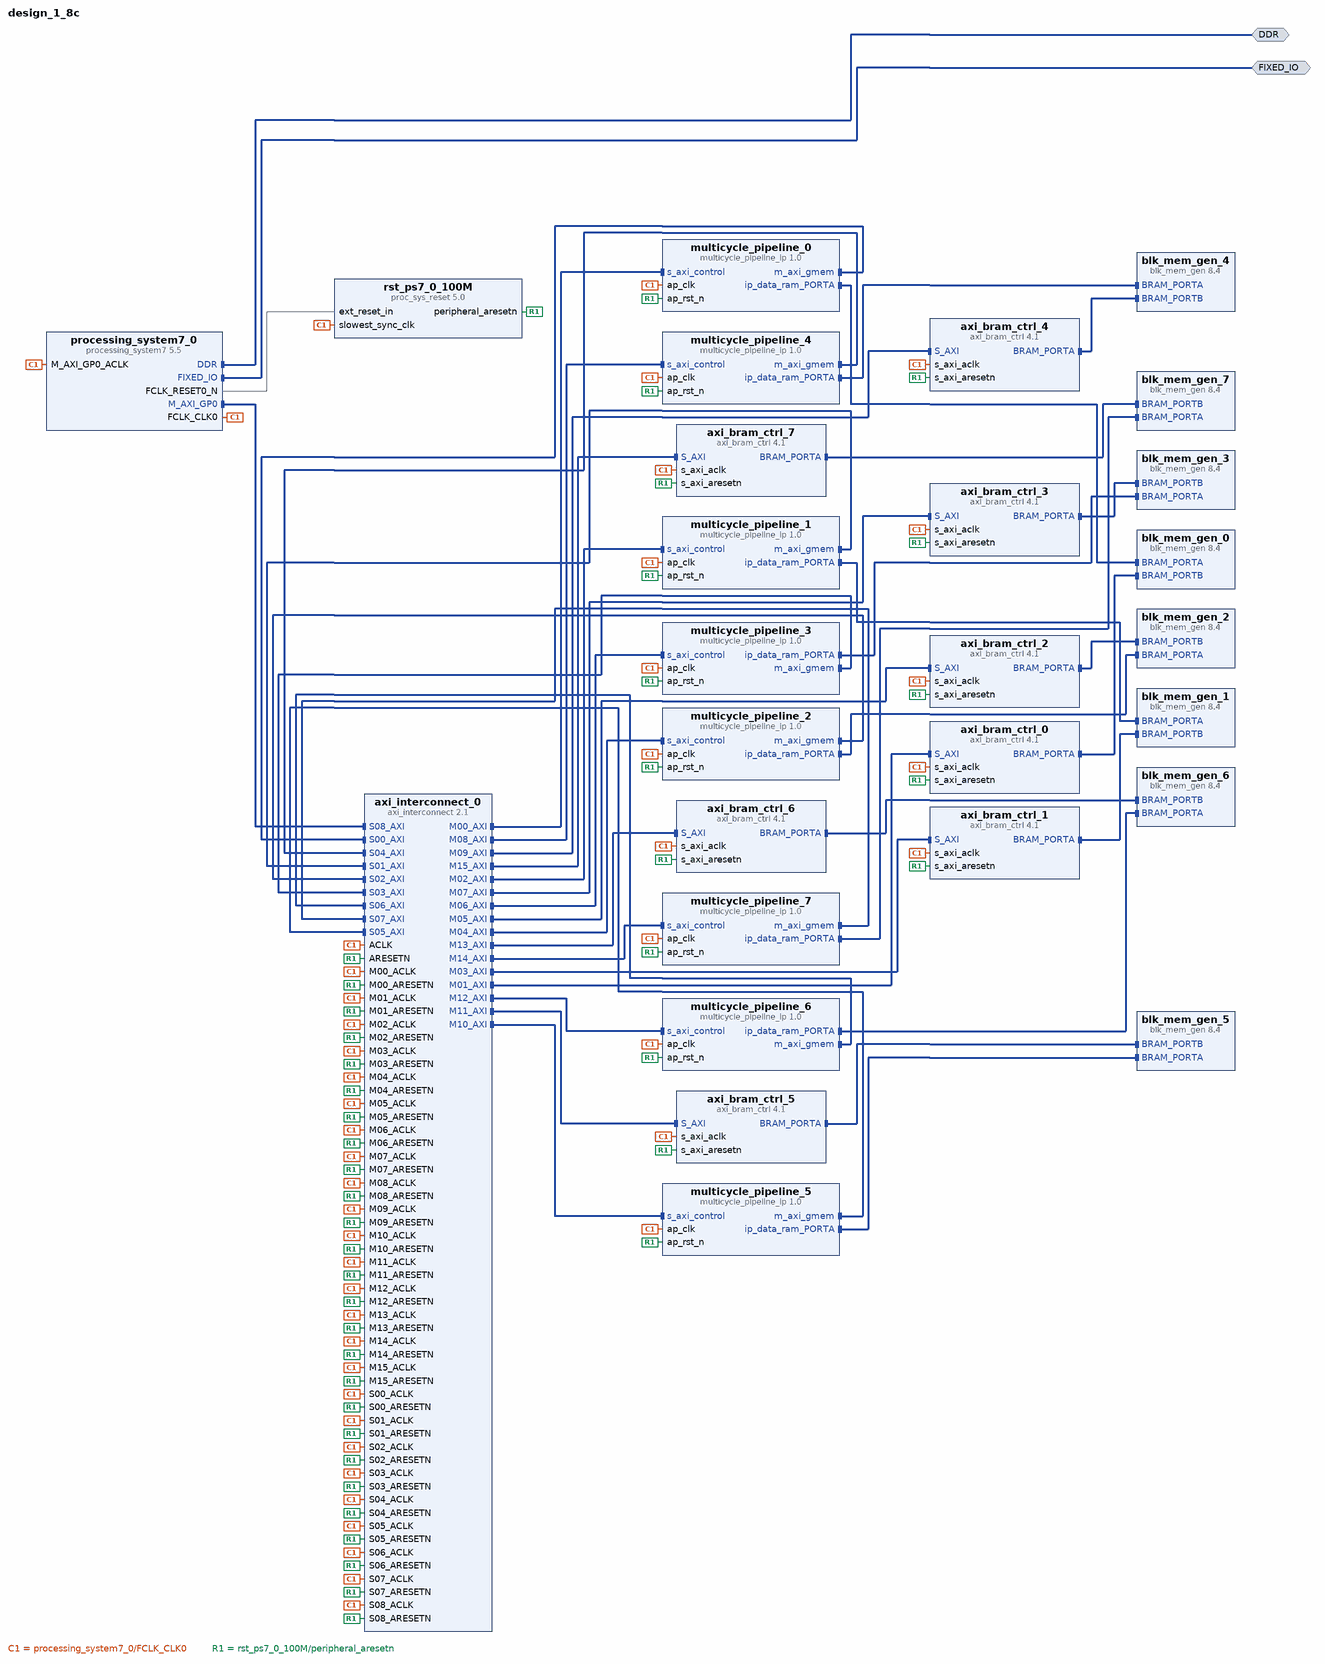
[diagram p0: block diagram of the top level]
# Vivado block design design_1_8c, xc7z020clg400-1, Vivado 2022.1
create_bd_design design_1_8c

create_bd_intf_port -mode Master -vlnv xilinx.com:interface:ddrx_rtl:1.0 DDR
create_bd_intf_port -mode Master -vlnv xilinx.com:display_processing_system7:fixedio_rtl:1.0 FIXED_IO

create_bd_cell -type ip -vlnv xilinx.com:ip:processing_system7:5.5 processing_system7_0
set_property -dict [list \
  CONFIG.PCW_APU_PERIPHERAL_FREQMHZ 650 \
  CONFIG.PCW_CRYSTAL_PERIPHERAL_FREQMHZ 50 \
  CONFIG.PCW_ENET0_ENET0_IO {MIO 16 .. 27} \
  CONFIG.PCW_ENET0_GRP_MDIO_ENABLE 1 \
  CONFIG.PCW_ENET0_GRP_MDIO_IO {MIO 52 .. 53} \
  CONFIG.PCW_ENET0_PERIPHERAL_ENABLE 1 \
  CONFIG.PCW_ENET0_RESET_ENABLE 1 \
  CONFIG.PCW_ENET0_RESET_IO {MIO 9} \
  CONFIG.PCW_ENET_RESET_ENABLE 1 \
  CONFIG.PCW_ENET_RESET_SELECT {Share reset pin} \
  CONFIG.PCW_FPGA0_PERIPHERAL_FREQMHZ 100 \
  CONFIG.PCW_FPGA1_PERIPHERAL_FREQMHZ 50 \
  CONFIG.PCW_GPIO_MIO_GPIO_ENABLE 1 \
  CONFIG.PCW_GPIO_MIO_GPIO_IO MIO \
  CONFIG.PCW_I2C_RESET_ENABLE 1 \
  CONFIG.PCW_M_AXI_GP0_FREQMHZ 10 \
  CONFIG.PCW_PERIPHERAL_BOARD_PRESET None \
  CONFIG.PCW_PRESET_BANK1_VOLTAGE {LVCMOS 1.8V} \
  CONFIG.PCW_QSPI_GRP_FBCLK_ENABLE 1 \
  CONFIG.PCW_QSPI_GRP_FBCLK_IO {MIO 8} \
  CONFIG.PCW_QSPI_GRP_SINGLE_SS_ENABLE 1 \
  CONFIG.PCW_QSPI_GRP_SINGLE_SS_IO {MIO 1 .. 6} \
  CONFIG.PCW_QSPI_PERIPHERAL_ENABLE 1 \
  CONFIG.PCW_QSPI_QSPI_IO {MIO 1 .. 6} \
  CONFIG.PCW_SD0_GRP_CD_ENABLE 1 \
  CONFIG.PCW_SD0_GRP_CD_IO {MIO 47} \
  CONFIG.PCW_SD0_GRP_WP_ENABLE 0 \
  CONFIG.PCW_SD0_PERIPHERAL_ENABLE 1 \
  CONFIG.PCW_SD0_SD0_IO {MIO 40 .. 45} \
  CONFIG.PCW_SDIO_PERIPHERAL_FREQMHZ 50 \
  CONFIG.PCW_SINGLE_QSPI_DATA_MODE x4 \
  CONFIG.PCW_UART0_PERIPHERAL_ENABLE 1 \
  CONFIG.PCW_UART0_UART0_IO {MIO 14 .. 15} \
  CONFIG.PCW_UART1_PERIPHERAL_ENABLE 0 \
  CONFIG.PCW_UART_PERIPHERAL_FREQMHZ 100 \
  CONFIG.PCW_UIPARAM_DDR_BUS_WIDTH {16 Bit} \
  CONFIG.PCW_UIPARAM_DDR_FREQ_MHZ 525 \
  CONFIG.PCW_UIPARAM_DDR_PARTNO {MT41J256M16 RE-125} \
  CONFIG.PCW_USB0_PERIPHERAL_ENABLE 1 \
  CONFIG.PCW_USB0_RESET_ENABLE 1 \
  CONFIG.PCW_USB0_RESET_IO {MIO 46} \
  CONFIG.PCW_USB0_USB0_IO {MIO 28 .. 39} \
  CONFIG.PCW_USB_RESET_ENABLE 1 \
  CONFIG.PCW_USB_RESET_SELECT {Share reset pin} \
] [get_bd_cells processing_system7_0]
# 481 more settings of processing_system7_0 are not shown: defaults, MIO pin electricals, DDR timing, and values the tool derives
create_bd_cell -type ip -vlnv xilinx.com:ip:axi_bram_ctrl:4.1 axi_bram_ctrl_0
set_property -dict {CONFIG.PROTOCOL AXI4LITE CONFIG.SINGLE_PORT_BRAM 1} [get_bd_cells axi_bram_ctrl_0]
create_bd_cell -type ip -vlnv xilinx.com:ip:axi_bram_ctrl:4.1 axi_bram_ctrl_1
set_property -dict {CONFIG.PROTOCOL AXI4LITE CONFIG.SINGLE_PORT_BRAM 1} [get_bd_cells axi_bram_ctrl_1]
create_bd_cell -type ip -vlnv xilinx.com:ip:axi_bram_ctrl:4.1 axi_bram_ctrl_2
set_property -dict {CONFIG.PROTOCOL AXI4LITE CONFIG.SINGLE_PORT_BRAM 1} [get_bd_cells axi_bram_ctrl_2]
create_bd_cell -type ip -vlnv xilinx.com:ip:axi_bram_ctrl:4.1 axi_bram_ctrl_3
set_property -dict {CONFIG.PROTOCOL AXI4LITE CONFIG.SINGLE_PORT_BRAM 1} [get_bd_cells axi_bram_ctrl_3]
create_bd_cell -type ip -vlnv xilinx.com:ip:axi_bram_ctrl:4.1 axi_bram_ctrl_4
set_property -dict {CONFIG.PROTOCOL AXI4LITE CONFIG.SINGLE_PORT_BRAM 1} [get_bd_cells axi_bram_ctrl_4]
create_bd_cell -type ip -vlnv xilinx.com:ip:axi_bram_ctrl:4.1 axi_bram_ctrl_5
set_property -dict {CONFIG.PROTOCOL AXI4LITE CONFIG.SINGLE_PORT_BRAM 1} [get_bd_cells axi_bram_ctrl_5]
create_bd_cell -type ip -vlnv xilinx.com:ip:axi_bram_ctrl:4.1 axi_bram_ctrl_6
set_property -dict {CONFIG.PROTOCOL AXI4LITE CONFIG.SINGLE_PORT_BRAM 1} [get_bd_cells axi_bram_ctrl_6]
create_bd_cell -type ip -vlnv xilinx.com:ip:axi_bram_ctrl:4.1 axi_bram_ctrl_7
set_property -dict {CONFIG.PROTOCOL AXI4LITE CONFIG.SINGLE_PORT_BRAM 1} [get_bd_cells axi_bram_ctrl_7]
create_bd_cell -type ip -vlnv xilinx.com:ip:blk_mem_gen:8.4 blk_mem_gen_0
set_property -dict [list \
  CONFIG.Enable_B Use_ENB_Pin \
  CONFIG.Memory_Type True_Dual_Port_RAM \
  CONFIG.Port_B_Clock 100 \
  CONFIG.Port_B_Enable_Rate 100 \
  CONFIG.Port_B_Write_Rate 50 \
  CONFIG.Use_RSTB_Pin true \
] [get_bd_cells blk_mem_gen_0]
create_bd_cell -type ip -vlnv xilinx.com:ip:blk_mem_gen:8.4 blk_mem_gen_1
set_property -dict [list \
  CONFIG.Enable_B Use_ENB_Pin \
  CONFIG.Memory_Type True_Dual_Port_RAM \
  CONFIG.Port_B_Clock 100 \
  CONFIG.Port_B_Enable_Rate 100 \
  CONFIG.Port_B_Write_Rate 50 \
  CONFIG.Use_RSTB_Pin true \
] [get_bd_cells blk_mem_gen_1]
create_bd_cell -type ip -vlnv xilinx.com:ip:blk_mem_gen:8.4 blk_mem_gen_2
set_property -dict [list \
  CONFIG.Enable_B Use_ENB_Pin \
  CONFIG.Memory_Type True_Dual_Port_RAM \
  CONFIG.Port_B_Clock 100 \
  CONFIG.Port_B_Enable_Rate 100 \
  CONFIG.Port_B_Write_Rate 50 \
  CONFIG.Use_RSTB_Pin true \
] [get_bd_cells blk_mem_gen_2]
create_bd_cell -type ip -vlnv xilinx.com:ip:blk_mem_gen:8.4 blk_mem_gen_3
set_property -dict [list \
  CONFIG.Enable_B Use_ENB_Pin \
  CONFIG.Memory_Type True_Dual_Port_RAM \
  CONFIG.Port_B_Clock 100 \
  CONFIG.Port_B_Enable_Rate 100 \
  CONFIG.Port_B_Write_Rate 50 \
  CONFIG.Use_RSTB_Pin true \
] [get_bd_cells blk_mem_gen_3]
create_bd_cell -type ip -vlnv xilinx.com:ip:blk_mem_gen:8.4 blk_mem_gen_4
set_property -dict [list \
  CONFIG.Enable_B Use_ENB_Pin \
  CONFIG.Memory_Type True_Dual_Port_RAM \
  CONFIG.Port_B_Clock 100 \
  CONFIG.Port_B_Enable_Rate 100 \
  CONFIG.Port_B_Write_Rate 50 \
  CONFIG.Use_RSTB_Pin true \
] [get_bd_cells blk_mem_gen_4]
create_bd_cell -type ip -vlnv xilinx.com:ip:blk_mem_gen:8.4 blk_mem_gen_5
set_property -dict [list \
  CONFIG.Enable_B Use_ENB_Pin \
  CONFIG.Memory_Type True_Dual_Port_RAM \
  CONFIG.Port_B_Clock 100 \
  CONFIG.Port_B_Enable_Rate 100 \
  CONFIG.Port_B_Write_Rate 50 \
  CONFIG.Use_RSTB_Pin true \
] [get_bd_cells blk_mem_gen_5]
create_bd_cell -type ip -vlnv xilinx.com:ip:blk_mem_gen:8.4 blk_mem_gen_6
set_property -dict [list \
  CONFIG.Enable_B Use_ENB_Pin \
  CONFIG.Memory_Type True_Dual_Port_RAM \
  CONFIG.Port_B_Clock 100 \
  CONFIG.Port_B_Enable_Rate 100 \
  CONFIG.Port_B_Write_Rate 50 \
  CONFIG.Use_RSTB_Pin true \
] [get_bd_cells blk_mem_gen_6]
create_bd_cell -type ip -vlnv xilinx.com:ip:blk_mem_gen:8.4 blk_mem_gen_7
set_property -dict [list \
  CONFIG.Enable_B Use_ENB_Pin \
  CONFIG.Memory_Type True_Dual_Port_RAM \
  CONFIG.Port_B_Clock 100 \
  CONFIG.Port_B_Enable_Rate 100 \
  CONFIG.Port_B_Write_Rate 50 \
  CONFIG.Use_RSTB_Pin true \
] [get_bd_cells blk_mem_gen_7]
create_bd_cell -type ip -vlnv xilinx.com:ip:proc_sys_reset:5.0 rst_ps7_0_100M
create_bd_cell -type ip -vlnv xilinx.com:ip:axi_interconnect:2.1 axi_interconnect_0
set_property -dict {CONFIG.NUM_MI 16 CONFIG.NUM_SI 9} [get_bd_cells axi_interconnect_0]
create_bd_cell -type ip -vlnv xilinx.com:hls:multicycle_pipeline_ip:1.0 multicycle_pipeline_0
create_bd_cell -type ip -vlnv xilinx.com:hls:multicycle_pipeline_ip:1.0 multicycle_pipeline_1
create_bd_cell -type ip -vlnv xilinx.com:hls:multicycle_pipeline_ip:1.0 multicycle_pipeline_2
create_bd_cell -type ip -vlnv xilinx.com:hls:multicycle_pipeline_ip:1.0 multicycle_pipeline_3
create_bd_cell -type ip -vlnv xilinx.com:hls:multicycle_pipeline_ip:1.0 multicycle_pipeline_4
create_bd_cell -type ip -vlnv xilinx.com:hls:multicycle_pipeline_ip:1.0 multicycle_pipeline_5
create_bd_cell -type ip -vlnv xilinx.com:hls:multicycle_pipeline_ip:1.0 multicycle_pipeline_6
create_bd_cell -type ip -vlnv xilinx.com:hls:multicycle_pipeline_ip:1.0 multicycle_pipeline_7

# ---- connections ----

connect_bd_intf_net [get_bd_intf_pins axi_interconnect_0/S08_AXI] [get_bd_intf_pins processing_system7_0/M_AXI_GP0]
connect_bd_intf_net [get_bd_intf_pins blk_mem_gen_0/BRAM_PORTB] [get_bd_intf_pins axi_bram_ctrl_0/BRAM_PORTA]
connect_bd_intf_net [get_bd_intf_pins blk_mem_gen_1/BRAM_PORTB] [get_bd_intf_pins axi_bram_ctrl_1/BRAM_PORTA]
connect_bd_intf_net [get_bd_intf_pins blk_mem_gen_2/BRAM_PORTB] [get_bd_intf_pins axi_bram_ctrl_2/BRAM_PORTA]
connect_bd_intf_net [get_bd_intf_pins blk_mem_gen_3/BRAM_PORTB] [get_bd_intf_pins axi_bram_ctrl_3/BRAM_PORTA]
connect_bd_intf_net [get_bd_intf_pins blk_mem_gen_4/BRAM_PORTB] [get_bd_intf_pins axi_bram_ctrl_4/BRAM_PORTA]
connect_bd_intf_net [get_bd_intf_pins blk_mem_gen_5/BRAM_PORTB] [get_bd_intf_pins axi_bram_ctrl_5/BRAM_PORTA]
connect_bd_intf_net [get_bd_intf_pins blk_mem_gen_6/BRAM_PORTB] [get_bd_intf_pins axi_bram_ctrl_6/BRAM_PORTA]
connect_bd_intf_net [get_bd_intf_pins blk_mem_gen_7/BRAM_PORTB] [get_bd_intf_pins axi_bram_ctrl_7/BRAM_PORTA]
connect_bd_intf_net [get_bd_intf_pins axi_interconnect_0/M00_AXI] [get_bd_intf_pins multicycle_pipeline_0/s_axi_control]
connect_bd_intf_net [get_bd_intf_pins axi_interconnect_0/M01_AXI] [get_bd_intf_pins axi_bram_ctrl_0/S_AXI]
connect_bd_intf_net [get_bd_intf_pins axi_interconnect_0/M02_AXI] [get_bd_intf_pins multicycle_pipeline_1/s_axi_control]
connect_bd_intf_net [get_bd_intf_pins axi_interconnect_0/M03_AXI] [get_bd_intf_pins axi_bram_ctrl_1/S_AXI]
connect_bd_intf_net [get_bd_intf_pins axi_interconnect_0/M04_AXI] [get_bd_intf_pins multicycle_pipeline_2/s_axi_control]
connect_bd_intf_net [get_bd_intf_pins axi_interconnect_0/M05_AXI] [get_bd_intf_pins axi_bram_ctrl_2/S_AXI]
connect_bd_intf_net [get_bd_intf_pins axi_interconnect_0/M06_AXI] [get_bd_intf_pins multicycle_pipeline_3/s_axi_control]
connect_bd_intf_net [get_bd_intf_pins axi_interconnect_0/M07_AXI] [get_bd_intf_pins axi_bram_ctrl_3/S_AXI]
connect_bd_intf_net [get_bd_intf_pins axi_interconnect_0/M08_AXI] [get_bd_intf_pins multicycle_pipeline_4/s_axi_control]
connect_bd_intf_net [get_bd_intf_pins axi_interconnect_0/M09_AXI] [get_bd_intf_pins axi_bram_ctrl_4/S_AXI]
connect_bd_intf_net [get_bd_intf_pins axi_interconnect_0/M10_AXI] [get_bd_intf_pins multicycle_pipeline_5/s_axi_control]
connect_bd_intf_net [get_bd_intf_pins axi_interconnect_0/M11_AXI] [get_bd_intf_pins axi_bram_ctrl_5/S_AXI]
connect_bd_intf_net [get_bd_intf_pins axi_interconnect_0/M12_AXI] [get_bd_intf_pins multicycle_pipeline_6/s_axi_control]
connect_bd_intf_net [get_bd_intf_pins axi_interconnect_0/M13_AXI] [get_bd_intf_pins axi_bram_ctrl_6/S_AXI]
connect_bd_intf_net [get_bd_intf_pins axi_interconnect_0/M14_AXI] [get_bd_intf_pins multicycle_pipeline_7/s_axi_control]
connect_bd_intf_net [get_bd_intf_pins axi_interconnect_0/M15_AXI] [get_bd_intf_pins axi_bram_ctrl_7/S_AXI]
connect_bd_intf_net [get_bd_intf_pins blk_mem_gen_0/BRAM_PORTA] [get_bd_intf_pins multicycle_pipeline_0/ip_data_ram_PORTA]
connect_bd_intf_net [get_bd_intf_pins multicycle_pipeline_0/m_axi_gmem] [get_bd_intf_pins axi_interconnect_0/S00_AXI]
connect_bd_intf_net [get_bd_intf_pins blk_mem_gen_1/BRAM_PORTA] [get_bd_intf_pins multicycle_pipeline_1/ip_data_ram_PORTA]
connect_bd_intf_net [get_bd_intf_pins multicycle_pipeline_1/m_axi_gmem] [get_bd_intf_pins axi_interconnect_0/S01_AXI]
connect_bd_intf_net [get_bd_intf_pins blk_mem_gen_2/BRAM_PORTA] [get_bd_intf_pins multicycle_pipeline_2/ip_data_ram_PORTA]
connect_bd_intf_net [get_bd_intf_pins multicycle_pipeline_2/m_axi_gmem] [get_bd_intf_pins axi_interconnect_0/S02_AXI]
connect_bd_intf_net [get_bd_intf_pins blk_mem_gen_3/BRAM_PORTA] [get_bd_intf_pins multicycle_pipeline_3/ip_data_ram_PORTA]
connect_bd_intf_net [get_bd_intf_pins multicycle_pipeline_3/m_axi_gmem] [get_bd_intf_pins axi_interconnect_0/S03_AXI]
connect_bd_intf_net [get_bd_intf_pins blk_mem_gen_4/BRAM_PORTA] [get_bd_intf_pins multicycle_pipeline_4/ip_data_ram_PORTA]
connect_bd_intf_net [get_bd_intf_pins multicycle_pipeline_4/m_axi_gmem] [get_bd_intf_pins axi_interconnect_0/S04_AXI]
connect_bd_intf_net [get_bd_intf_pins blk_mem_gen_5/BRAM_PORTA] [get_bd_intf_pins multicycle_pipeline_5/ip_data_ram_PORTA]
connect_bd_intf_net [get_bd_intf_pins multicycle_pipeline_5/m_axi_gmem] [get_bd_intf_pins axi_interconnect_0/S05_AXI]
connect_bd_intf_net [get_bd_intf_pins blk_mem_gen_6/BRAM_PORTA] [get_bd_intf_pins multicycle_pipeline_6/ip_data_ram_PORTA]
connect_bd_intf_net [get_bd_intf_pins multicycle_pipeline_6/m_axi_gmem] [get_bd_intf_pins axi_interconnect_0/S06_AXI]
connect_bd_intf_net [get_bd_intf_pins blk_mem_gen_7/BRAM_PORTA] [get_bd_intf_pins multicycle_pipeline_7/ip_data_ram_PORTA]
connect_bd_intf_net [get_bd_intf_pins multicycle_pipeline_7/m_axi_gmem] [get_bd_intf_pins axi_interconnect_0/S07_AXI]
connect_bd_intf_net [get_bd_intf_ports DDR] [get_bd_intf_pins processing_system7_0/DDR]
connect_bd_intf_net [get_bd_intf_ports FIXED_IO] [get_bd_intf_pins processing_system7_0/FIXED_IO]
connect_bd_net [get_bd_pins processing_system7_0/FCLK_CLK0] \
  [get_bd_pins axi_bram_ctrl_0/s_axi_aclk] [get_bd_pins rst_ps7_0_100M/slowest_sync_clk] \
  [get_bd_pins axi_bram_ctrl_1/s_axi_aclk] [get_bd_pins axi_bram_ctrl_2/s_axi_aclk] [get_bd_pins axi_bram_ctrl_3/s_axi_aclk] \
  [get_bd_pins axi_bram_ctrl_4/s_axi_aclk] [get_bd_pins axi_bram_ctrl_5/s_axi_aclk] [get_bd_pins axi_bram_ctrl_6/s_axi_aclk] \
  [get_bd_pins axi_bram_ctrl_7/s_axi_aclk] [get_bd_pins processing_system7_0/M_AXI_GP0_ACLK] \
  [get_bd_pins axi_interconnect_0/ACLK] [get_bd_pins axi_interconnect_0/M00_ACLK] [get_bd_pins axi_interconnect_0/M01_ACLK] \
  [get_bd_pins axi_interconnect_0/M02_ACLK] [get_bd_pins axi_interconnect_0/M03_ACLK] \
  [get_bd_pins axi_interconnect_0/M04_ACLK] [get_bd_pins axi_interconnect_0/M05_ACLK] \
  [get_bd_pins axi_interconnect_0/M06_ACLK] [get_bd_pins axi_interconnect_0/M07_ACLK] \
  [get_bd_pins axi_interconnect_0/M08_ACLK] [get_bd_pins axi_interconnect_0/M09_ACLK] \
  [get_bd_pins axi_interconnect_0/M10_ACLK] [get_bd_pins axi_interconnect_0/M11_ACLK] \
  [get_bd_pins axi_interconnect_0/M12_ACLK] [get_bd_pins axi_interconnect_0/M13_ACLK] \
  [get_bd_pins axi_interconnect_0/M14_ACLK] [get_bd_pins axi_interconnect_0/M15_ACLK] \
  [get_bd_pins axi_interconnect_0/S00_ACLK] [get_bd_pins axi_interconnect_0/S01_ACLK] \
  [get_bd_pins axi_interconnect_0/S02_ACLK] [get_bd_pins axi_interconnect_0/S03_ACLK] \
  [get_bd_pins axi_interconnect_0/S04_ACLK] [get_bd_pins axi_interconnect_0/S05_ACLK] \
  [get_bd_pins axi_interconnect_0/S06_ACLK] [get_bd_pins axi_interconnect_0/S07_ACLK] \
  [get_bd_pins axi_interconnect_0/S08_ACLK] [get_bd_pins multicycle_pipeline_0/ap_clk] \
  [get_bd_pins multicycle_pipeline_1/ap_clk] [get_bd_pins multicycle_pipeline_2/ap_clk] \
  [get_bd_pins multicycle_pipeline_3/ap_clk] [get_bd_pins multicycle_pipeline_4/ap_clk] \
  [get_bd_pins multicycle_pipeline_5/ap_clk] [get_bd_pins multicycle_pipeline_6/ap_clk] \
  [get_bd_pins multicycle_pipeline_7/ap_clk]
connect_bd_net [get_bd_pins processing_system7_0/FCLK_RESET0_N] [get_bd_pins rst_ps7_0_100M/ext_reset_in]
connect_bd_net [get_bd_pins rst_ps7_0_100M/peripheral_aresetn] \
  [get_bd_pins axi_bram_ctrl_0/s_axi_aresetn] [get_bd_pins axi_bram_ctrl_1/s_axi_aresetn] \
  [get_bd_pins axi_bram_ctrl_2/s_axi_aresetn] [get_bd_pins axi_bram_ctrl_3/s_axi_aresetn] \
  [get_bd_pins axi_bram_ctrl_4/s_axi_aresetn] [get_bd_pins axi_bram_ctrl_5/s_axi_aresetn] \
  [get_bd_pins axi_bram_ctrl_6/s_axi_aresetn] [get_bd_pins axi_bram_ctrl_7/s_axi_aresetn] \
  [get_bd_pins axi_interconnect_0/ARESETN] [get_bd_pins axi_interconnect_0/M00_ARESETN] \
  [get_bd_pins axi_interconnect_0/M01_ARESETN] [get_bd_pins axi_interconnect_0/M02_ARESETN] \
  [get_bd_pins axi_interconnect_0/M03_ARESETN] [get_bd_pins axi_interconnect_0/M04_ARESETN] \
  [get_bd_pins axi_interconnect_0/M05_ARESETN] [get_bd_pins axi_interconnect_0/M06_ARESETN] \
  [get_bd_pins axi_interconnect_0/M07_ARESETN] [get_bd_pins axi_interconnect_0/M08_ARESETN] \
  [get_bd_pins axi_interconnect_0/M09_ARESETN] [get_bd_pins axi_interconnect_0/M10_ARESETN] \
  [get_bd_pins axi_interconnect_0/M11_ARESETN] [get_bd_pins axi_interconnect_0/M12_ARESETN] \
  [get_bd_pins axi_interconnect_0/M13_ARESETN] [get_bd_pins axi_interconnect_0/M14_ARESETN] \
  [get_bd_pins axi_interconnect_0/M15_ARESETN] [get_bd_pins axi_interconnect_0/S00_ARESETN] \
  [get_bd_pins axi_interconnect_0/S01_ARESETN] [get_bd_pins axi_interconnect_0/S02_ARESETN] \
  [get_bd_pins axi_interconnect_0/S03_ARESETN] [get_bd_pins axi_interconnect_0/S04_ARESETN] \
  [get_bd_pins axi_interconnect_0/S05_ARESETN] [get_bd_pins axi_interconnect_0/S06_ARESETN] \
  [get_bd_pins axi_interconnect_0/S07_ARESETN] [get_bd_pins axi_interconnect_0/S08_ARESETN] \
  [get_bd_pins multicycle_pipeline_0/ap_rst_n] [get_bd_pins multicycle_pipeline_1/ap_rst_n] \
  [get_bd_pins multicycle_pipeline_2/ap_rst_n] [get_bd_pins multicycle_pipeline_3/ap_rst_n] \
  [get_bd_pins multicycle_pipeline_4/ap_rst_n] [get_bd_pins multicycle_pipeline_5/ap_rst_n] \
  [get_bd_pins multicycle_pipeline_6/ap_rst_n] [get_bd_pins multicycle_pipeline_7/ap_rst_n]
set_property HDL_ATTRIBUTE.BMM_INFO_PROCESSOR {arm > design_1_8c axi_bram_ctrl_0 design_1_8c axi_bram_ctrl_1 design_1_8c axi_bram_ctrl_2 design_1_8c axi_bram_ctrl_3 design_1_8c axi_bram_ctrl_4 design_1_8c axi_bram_ctrl_5 design_1_8c axi_bram_ctrl_6 design_1_8c axi_bram_ctrl_7} [get_bd_cells processing_system7_0]
set_property HDL_ATTRIBUTE.KEEP_HIERARCHY yes [get_bd_cells processing_system7_0]
set_property HDL_ATTRIBUTE.BMM_INFO_ADDRESS_SPACE {byte  0x40000000 32 > design_1_8c blk_mem_gen_0} [get_bd_cells axi_bram_ctrl_0]
set_property HDL_ATTRIBUTE.KEEP_HIERARCHY yes [get_bd_cells axi_bram_ctrl_0]
set_property HDL_ATTRIBUTE.BMM_INFO_ADDRESS_SPACE {byte  0x40008000 32 > design_1_8c blk_mem_gen_1} [get_bd_cells axi_bram_ctrl_1]
set_property HDL_ATTRIBUTE.KEEP_HIERARCHY yes [get_bd_cells axi_bram_ctrl_1]
set_property HDL_ATTRIBUTE.BMM_INFO_ADDRESS_SPACE {byte  0x40010000 32 > design_1_8c blk_mem_gen_2} [get_bd_cells axi_bram_ctrl_2]
set_property HDL_ATTRIBUTE.KEEP_HIERARCHY yes [get_bd_cells axi_bram_ctrl_2]
set_property HDL_ATTRIBUTE.BMM_INFO_ADDRESS_SPACE {byte  0x40018000 32 > design_1_8c blk_mem_gen_3} [get_bd_cells axi_bram_ctrl_3]
set_property HDL_ATTRIBUTE.KEEP_HIERARCHY yes [get_bd_cells axi_bram_ctrl_3]
set_property HDL_ATTRIBUTE.BMM_INFO_ADDRESS_SPACE {byte  0x40020000 32 > design_1_8c blk_mem_gen_4} [get_bd_cells axi_bram_ctrl_4]
set_property HDL_ATTRIBUTE.KEEP_HIERARCHY yes [get_bd_cells axi_bram_ctrl_4]
set_property HDL_ATTRIBUTE.BMM_INFO_ADDRESS_SPACE {byte  0x40028000 32 > design_1_8c blk_mem_gen_5} [get_bd_cells axi_bram_ctrl_5]
set_property HDL_ATTRIBUTE.KEEP_HIERARCHY yes [get_bd_cells axi_bram_ctrl_5]
set_property HDL_ATTRIBUTE.BMM_INFO_ADDRESS_SPACE {byte  0x40030000 32 > design_1_8c blk_mem_gen_6} [get_bd_cells axi_bram_ctrl_6]
set_property HDL_ATTRIBUTE.KEEP_HIERARCHY yes [get_bd_cells axi_bram_ctrl_6]
set_property HDL_ATTRIBUTE.BMM_INFO_ADDRESS_SPACE {byte  0x40038000 32 > design_1_8c blk_mem_gen_7} [get_bd_cells axi_bram_ctrl_7]
set_property HDL_ATTRIBUTE.KEEP_HIERARCHY yes [get_bd_cells axi_bram_ctrl_7]

# ---- address map ----
assign_bd_address -offset 0x0000000040000000 -range 32K -target_address_space [get_bd_addr_spaces multicycle_pipeline_0/Data_m_axi_gmem] [get_bd_addr_segs axi_bram_ctrl_0/S_AXI/Mem0]
assign_bd_address -offset 0x0000000040008000 -range 32K -target_address_space [get_bd_addr_spaces multicycle_pipeline_0/Data_m_axi_gmem] [get_bd_addr_segs axi_bram_ctrl_1/S_AXI/Mem0]
assign_bd_address -offset 0x0000000040010000 -range 32K -target_address_space [get_bd_addr_spaces multicycle_pipeline_0/Data_m_axi_gmem] [get_bd_addr_segs axi_bram_ctrl_2/S_AXI/Mem0]
assign_bd_address -offset 0x0000000040018000 -range 32K -target_address_space [get_bd_addr_spaces multicycle_pipeline_0/Data_m_axi_gmem] [get_bd_addr_segs axi_bram_ctrl_3/S_AXI/Mem0]
assign_bd_address -offset 0x0000000040020000 -range 32K -target_address_space [get_bd_addr_spaces multicycle_pipeline_0/Data_m_axi_gmem] [get_bd_addr_segs axi_bram_ctrl_4/S_AXI/Mem0]
assign_bd_address -offset 0x0000000040028000 -range 32K -target_address_space [get_bd_addr_spaces multicycle_pipeline_0/Data_m_axi_gmem] [get_bd_addr_segs axi_bram_ctrl_5/S_AXI/Mem0]
assign_bd_address -offset 0x0000000040030000 -range 32K -target_address_space [get_bd_addr_spaces multicycle_pipeline_0/Data_m_axi_gmem] [get_bd_addr_segs axi_bram_ctrl_6/S_AXI/Mem0]
assign_bd_address -offset 0x0000000040038000 -range 32K -target_address_space [get_bd_addr_spaces multicycle_pipeline_0/Data_m_axi_gmem] [get_bd_addr_segs axi_bram_ctrl_7/S_AXI/Mem0]
exclude_bd_addr_seg -offset 0x0000000040040000 -range 64K -target_address_space [get_bd_addr_spaces multicycle_pipeline_0/Data_m_axi_gmem] [get_bd_addr_segs multicycle_pipeline_0/s_axi_control/Reg]
exclude_bd_addr_seg -offset 0x0000000040050000 -range 64K -target_address_space [get_bd_addr_spaces multicycle_pipeline_0/Data_m_axi_gmem] [get_bd_addr_segs multicycle_pipeline_1/s_axi_control/Reg]
exclude_bd_addr_seg -offset 0x0000000040060000 -range 64K -target_address_space [get_bd_addr_spaces multicycle_pipeline_0/Data_m_axi_gmem] [get_bd_addr_segs multicycle_pipeline_2/s_axi_control/Reg]
exclude_bd_addr_seg -offset 0x0000000040070000 -range 64K -target_address_space [get_bd_addr_spaces multicycle_pipeline_0/Data_m_axi_gmem] [get_bd_addr_segs multicycle_pipeline_3/s_axi_control/Reg]
exclude_bd_addr_seg -offset 0x0000000040080000 -range 64K -target_address_space [get_bd_addr_spaces multicycle_pipeline_0/Data_m_axi_gmem] [get_bd_addr_segs multicycle_pipeline_4/s_axi_control/Reg]
exclude_bd_addr_seg -offset 0x0000000040090000 -range 64K -target_address_space [get_bd_addr_spaces multicycle_pipeline_0/Data_m_axi_gmem] [get_bd_addr_segs multicycle_pipeline_5/s_axi_control/Reg]
exclude_bd_addr_seg -offset 0x00000000400A0000 -range 64K -target_address_space [get_bd_addr_spaces multicycle_pipeline_0/Data_m_axi_gmem] [get_bd_addr_segs multicycle_pipeline_6/s_axi_control/Reg]
exclude_bd_addr_seg -offset 0x00000000400B0000 -range 64K -target_address_space [get_bd_addr_spaces multicycle_pipeline_0/Data_m_axi_gmem] [get_bd_addr_segs multicycle_pipeline_7/s_axi_control/Reg]
assign_bd_address -offset 0x0000000040000000 -range 32K -target_address_space [get_bd_addr_spaces multicycle_pipeline_1/Data_m_axi_gmem] [get_bd_addr_segs axi_bram_ctrl_0/S_AXI/Mem0]
assign_bd_address -offset 0x0000000040008000 -range 32K -target_address_space [get_bd_addr_spaces multicycle_pipeline_1/Data_m_axi_gmem] [get_bd_addr_segs axi_bram_ctrl_1/S_AXI/Mem0]
assign_bd_address -offset 0x0000000040010000 -range 32K -target_address_space [get_bd_addr_spaces multicycle_pipeline_1/Data_m_axi_gmem] [get_bd_addr_segs axi_bram_ctrl_2/S_AXI/Mem0]
assign_bd_address -offset 0x0000000040018000 -range 32K -target_address_space [get_bd_addr_spaces multicycle_pipeline_1/Data_m_axi_gmem] [get_bd_addr_segs axi_bram_ctrl_3/S_AXI/Mem0]
assign_bd_address -offset 0x0000000040020000 -range 32K -target_address_space [get_bd_addr_spaces multicycle_pipeline_1/Data_m_axi_gmem] [get_bd_addr_segs axi_bram_ctrl_4/S_AXI/Mem0]
assign_bd_address -offset 0x0000000040028000 -range 32K -target_address_space [get_bd_addr_spaces multicycle_pipeline_1/Data_m_axi_gmem] [get_bd_addr_segs axi_bram_ctrl_5/S_AXI/Mem0]
assign_bd_address -offset 0x0000000040030000 -range 32K -target_address_space [get_bd_addr_spaces multicycle_pipeline_1/Data_m_axi_gmem] [get_bd_addr_segs axi_bram_ctrl_6/S_AXI/Mem0]
assign_bd_address -offset 0x0000000040038000 -range 32K -target_address_space [get_bd_addr_spaces multicycle_pipeline_1/Data_m_axi_gmem] [get_bd_addr_segs axi_bram_ctrl_7/S_AXI/Mem0]
exclude_bd_addr_seg -offset 0x0000000040040000 -range 64K -target_address_space [get_bd_addr_spaces multicycle_pipeline_1/Data_m_axi_gmem] [get_bd_addr_segs multicycle_pipeline_0/s_axi_control/Reg]
exclude_bd_addr_seg -offset 0x0000000040050000 -range 64K -target_address_space [get_bd_addr_spaces multicycle_pipeline_1/Data_m_axi_gmem] [get_bd_addr_segs multicycle_pipeline_1/s_axi_control/Reg]
exclude_bd_addr_seg -offset 0x0000000040060000 -range 64K -target_address_space [get_bd_addr_spaces multicycle_pipeline_1/Data_m_axi_gmem] [get_bd_addr_segs multicycle_pipeline_2/s_axi_control/Reg]
exclude_bd_addr_seg -offset 0x0000000040070000 -range 64K -target_address_space [get_bd_addr_spaces multicycle_pipeline_1/Data_m_axi_gmem] [get_bd_addr_segs multicycle_pipeline_3/s_axi_control/Reg]
exclude_bd_addr_seg -offset 0x0000000040080000 -range 64K -target_address_space [get_bd_addr_spaces multicycle_pipeline_1/Data_m_axi_gmem] [get_bd_addr_segs multicycle_pipeline_4/s_axi_control/Reg]
exclude_bd_addr_seg -offset 0x0000000040090000 -range 64K -target_address_space [get_bd_addr_spaces multicycle_pipeline_1/Data_m_axi_gmem] [get_bd_addr_segs multicycle_pipeline_5/s_axi_control/Reg]
exclude_bd_addr_seg -offset 0x00000000400A0000 -range 64K -target_address_space [get_bd_addr_spaces multicycle_pipeline_1/Data_m_axi_gmem] [get_bd_addr_segs multicycle_pipeline_6/s_axi_control/Reg]
exclude_bd_addr_seg -offset 0x00000000400B0000 -range 64K -target_address_space [get_bd_addr_spaces multicycle_pipeline_1/Data_m_axi_gmem] [get_bd_addr_segs multicycle_pipeline_7/s_axi_control/Reg]
assign_bd_address -offset 0x0000000040000000 -range 32K -target_address_space [get_bd_addr_spaces multicycle_pipeline_2/Data_m_axi_gmem] [get_bd_addr_segs axi_bram_ctrl_0/S_AXI/Mem0]
assign_bd_address -offset 0x0000000040008000 -range 32K -target_address_space [get_bd_addr_spaces multicycle_pipeline_2/Data_m_axi_gmem] [get_bd_addr_segs axi_bram_ctrl_1/S_AXI/Mem0]
assign_bd_address -offset 0x0000000040010000 -range 32K -target_address_space [get_bd_addr_spaces multicycle_pipeline_2/Data_m_axi_gmem] [get_bd_addr_segs axi_bram_ctrl_2/S_AXI/Mem0]
assign_bd_address -offset 0x0000000040018000 -range 32K -target_address_space [get_bd_addr_spaces multicycle_pipeline_2/Data_m_axi_gmem] [get_bd_addr_segs axi_bram_ctrl_3/S_AXI/Mem0]
assign_bd_address -offset 0x0000000040020000 -range 32K -target_address_space [get_bd_addr_spaces multicycle_pipeline_2/Data_m_axi_gmem] [get_bd_addr_segs axi_bram_ctrl_4/S_AXI/Mem0]
assign_bd_address -offset 0x0000000040028000 -range 32K -target_address_space [get_bd_addr_spaces multicycle_pipeline_2/Data_m_axi_gmem] [get_bd_addr_segs axi_bram_ctrl_5/S_AXI/Mem0]
assign_bd_address -offset 0x0000000040030000 -range 32K -target_address_space [get_bd_addr_spaces multicycle_pipeline_2/Data_m_axi_gmem] [get_bd_addr_segs axi_bram_ctrl_6/S_AXI/Mem0]
assign_bd_address -offset 0x0000000040038000 -range 32K -target_address_space [get_bd_addr_spaces multicycle_pipeline_2/Data_m_axi_gmem] [get_bd_addr_segs axi_bram_ctrl_7/S_AXI/Mem0]
exclude_bd_addr_seg -offset 0x0000000040040000 -range 64K -target_address_space [get_bd_addr_spaces multicycle_pipeline_2/Data_m_axi_gmem] [get_bd_addr_segs multicycle_pipeline_0/s_axi_control/Reg]
exclude_bd_addr_seg -offset 0x0000000040050000 -range 64K -target_address_space [get_bd_addr_spaces multicycle_pipeline_2/Data_m_axi_gmem] [get_bd_addr_segs multicycle_pipeline_1/s_axi_control/Reg]
exclude_bd_addr_seg -offset 0x0000000040060000 -range 64K -target_address_space [get_bd_addr_spaces multicycle_pipeline_2/Data_m_axi_gmem] [get_bd_addr_segs multicycle_pipeline_2/s_axi_control/Reg]
exclude_bd_addr_seg -offset 0x0000000040070000 -range 64K -target_address_space [get_bd_addr_spaces multicycle_pipeline_2/Data_m_axi_gmem] [get_bd_addr_segs multicycle_pipeline_3/s_axi_control/Reg]
exclude_bd_addr_seg -offset 0x0000000040080000 -range 64K -target_address_space [get_bd_addr_spaces multicycle_pipeline_2/Data_m_axi_gmem] [get_bd_addr_segs multicycle_pipeline_4/s_axi_control/Reg]
exclude_bd_addr_seg -offset 0x0000000040090000 -range 64K -target_address_space [get_bd_addr_spaces multicycle_pipeline_2/Data_m_axi_gmem] [get_bd_addr_segs multicycle_pipeline_5/s_axi_control/Reg]
exclude_bd_addr_seg -offset 0x00000000400A0000 -range 64K -target_address_space [get_bd_addr_spaces multicycle_pipeline_2/Data_m_axi_gmem] [get_bd_addr_segs multicycle_pipeline_6/s_axi_control/Reg]
exclude_bd_addr_seg -offset 0x00000000400B0000 -range 64K -target_address_space [get_bd_addr_spaces multicycle_pipeline_2/Data_m_axi_gmem] [get_bd_addr_segs multicycle_pipeline_7/s_axi_control/Reg]
assign_bd_address -offset 0x0000000040000000 -range 32K -target_address_space [get_bd_addr_spaces multicycle_pipeline_3/Data_m_axi_gmem] [get_bd_addr_segs axi_bram_ctrl_0/S_AXI/Mem0]
assign_bd_address -offset 0x0000000040008000 -range 32K -target_address_space [get_bd_addr_spaces multicycle_pipeline_3/Data_m_axi_gmem] [get_bd_addr_segs axi_bram_ctrl_1/S_AXI/Mem0]
assign_bd_address -offset 0x0000000040010000 -range 32K -target_address_space [get_bd_addr_spaces multicycle_pipeline_3/Data_m_axi_gmem] [get_bd_addr_segs axi_bram_ctrl_2/S_AXI/Mem0]
assign_bd_address -offset 0x0000000040018000 -range 32K -target_address_space [get_bd_addr_spaces multicycle_pipeline_3/Data_m_axi_gmem] [get_bd_addr_segs axi_bram_ctrl_3/S_AXI/Mem0]
assign_bd_address -offset 0x0000000040020000 -range 32K -target_address_space [get_bd_addr_spaces multicycle_pipeline_3/Data_m_axi_gmem] [get_bd_addr_segs axi_bram_ctrl_4/S_AXI/Mem0]
assign_bd_address -offset 0x0000000040028000 -range 32K -target_address_space [get_bd_addr_spaces multicycle_pipeline_3/Data_m_axi_gmem] [get_bd_addr_segs axi_bram_ctrl_5/S_AXI/Mem0]
assign_bd_address -offset 0x0000000040030000 -range 32K -target_address_space [get_bd_addr_spaces multicycle_pipeline_3/Data_m_axi_gmem] [get_bd_addr_segs axi_bram_ctrl_6/S_AXI/Mem0]
assign_bd_address -offset 0x0000000040038000 -range 32K -target_address_space [get_bd_addr_spaces multicycle_pipeline_3/Data_m_axi_gmem] [get_bd_addr_segs axi_bram_ctrl_7/S_AXI/Mem0]
exclude_bd_addr_seg -offset 0x0000000040040000 -range 64K -target_address_space [get_bd_addr_spaces multicycle_pipeline_3/Data_m_axi_gmem] [get_bd_addr_segs multicycle_pipeline_0/s_axi_control/Reg]
exclude_bd_addr_seg -offset 0x0000000040050000 -range 64K -target_address_space [get_bd_addr_spaces multicycle_pipeline_3/Data_m_axi_gmem] [get_bd_addr_segs multicycle_pipeline_1/s_axi_control/Reg]
exclude_bd_addr_seg -offset 0x0000000040060000 -range 64K -target_address_space [get_bd_addr_spaces multicycle_pipeline_3/Data_m_axi_gmem] [get_bd_addr_segs multicycle_pipeline_2/s_axi_control/Reg]
exclude_bd_addr_seg -offset 0x0000000040070000 -range 64K -target_address_space [get_bd_addr_spaces multicycle_pipeline_3/Data_m_axi_gmem] [get_bd_addr_segs multicycle_pipeline_3/s_axi_control/Reg]
exclude_bd_addr_seg -offset 0x0000000040080000 -range 64K -target_address_space [get_bd_addr_spaces multicycle_pipeline_3/Data_m_axi_gmem] [get_bd_addr_segs multicycle_pipeline_4/s_axi_control/Reg]
exclude_bd_addr_seg -offset 0x0000000040090000 -range 64K -target_address_space [get_bd_addr_spaces multicycle_pipeline_3/Data_m_axi_gmem] [get_bd_addr_segs multicycle_pipeline_5/s_axi_control/Reg]
exclude_bd_addr_seg -offset 0x00000000400A0000 -range 64K -target_address_space [get_bd_addr_spaces multicycle_pipeline_3/Data_m_axi_gmem] [get_bd_addr_segs multicycle_pipeline_6/s_axi_control/Reg]
exclude_bd_addr_seg -offset 0x00000000400B0000 -range 64K -target_address_space [get_bd_addr_spaces multicycle_pipeline_3/Data_m_axi_gmem] [get_bd_addr_segs multicycle_pipeline_7/s_axi_control/Reg]
assign_bd_address -offset 0x0000000040000000 -range 32K -target_address_space [get_bd_addr_spaces multicycle_pipeline_4/Data_m_axi_gmem] [get_bd_addr_segs axi_bram_ctrl_0/S_AXI/Mem0]
assign_bd_address -offset 0x0000000040008000 -range 32K -target_address_space [get_bd_addr_spaces multicycle_pipeline_4/Data_m_axi_gmem] [get_bd_addr_segs axi_bram_ctrl_1/S_AXI/Mem0]
assign_bd_address -offset 0x0000000040010000 -range 32K -target_address_space [get_bd_addr_spaces multicycle_pipeline_4/Data_m_axi_gmem] [get_bd_addr_segs axi_bram_ctrl_2/S_AXI/Mem0]
assign_bd_address -offset 0x0000000040018000 -range 32K -target_address_space [get_bd_addr_spaces multicycle_pipeline_4/Data_m_axi_gmem] [get_bd_addr_segs axi_bram_ctrl_3/S_AXI/Mem0]
assign_bd_address -offset 0x0000000040020000 -range 32K -target_address_space [get_bd_addr_spaces multicycle_pipeline_4/Data_m_axi_gmem] [get_bd_addr_segs axi_bram_ctrl_4/S_AXI/Mem0]
assign_bd_address -offset 0x0000000040028000 -range 32K -target_address_space [get_bd_addr_spaces multicycle_pipeline_4/Data_m_axi_gmem] [get_bd_addr_segs axi_bram_ctrl_5/S_AXI/Mem0]
assign_bd_address -offset 0x0000000040030000 -range 32K -target_address_space [get_bd_addr_spaces multicycle_pipeline_4/Data_m_axi_gmem] [get_bd_addr_segs axi_bram_ctrl_6/S_AXI/Mem0]
assign_bd_address -offset 0x0000000040038000 -range 32K -target_address_space [get_bd_addr_spaces multicycle_pipeline_4/Data_m_axi_gmem] [get_bd_addr_segs axi_bram_ctrl_7/S_AXI/Mem0]
exclude_bd_addr_seg -offset 0x0000000040040000 -range 64K -target_address_space [get_bd_addr_spaces multicycle_pipeline_4/Data_m_axi_gmem] [get_bd_addr_segs multicycle_pipeline_0/s_axi_control/Reg]
exclude_bd_addr_seg -offset 0x0000000040050000 -range 64K -target_address_space [get_bd_addr_spaces multicycle_pipeline_4/Data_m_axi_gmem] [get_bd_addr_segs multicycle_pipeline_1/s_axi_control/Reg]
exclude_bd_addr_seg -offset 0x0000000040060000 -range 64K -target_address_space [get_bd_addr_spaces multicycle_pipeline_4/Data_m_axi_gmem] [get_bd_addr_segs multicycle_pipeline_2/s_axi_control/Reg]
exclude_bd_addr_seg -offset 0x0000000040070000 -range 64K -target_address_space [get_bd_addr_spaces multicycle_pipeline_4/Data_m_axi_gmem] [get_bd_addr_segs multicycle_pipeline_3/s_axi_control/Reg]
exclude_bd_addr_seg -offset 0x0000000040080000 -range 64K -target_address_space [get_bd_addr_spaces multicycle_pipeline_4/Data_m_axi_gmem] [get_bd_addr_segs multicycle_pipeline_4/s_axi_control/Reg]
exclude_bd_addr_seg -offset 0x0000000040090000 -range 64K -target_address_space [get_bd_addr_spaces multicycle_pipeline_4/Data_m_axi_gmem] [get_bd_addr_segs multicycle_pipeline_5/s_axi_control/Reg]
exclude_bd_addr_seg -offset 0x00000000400A0000 -range 64K -target_address_space [get_bd_addr_spaces multicycle_pipeline_4/Data_m_axi_gmem] [get_bd_addr_segs multicycle_pipeline_6/s_axi_control/Reg]
exclude_bd_addr_seg -offset 0x00000000400B0000 -range 64K -target_address_space [get_bd_addr_spaces multicycle_pipeline_4/Data_m_axi_gmem] [get_bd_addr_segs multicycle_pipeline_7/s_axi_control/Reg]
assign_bd_address -offset 0x0000000040000000 -range 32K -target_address_space [get_bd_addr_spaces multicycle_pipeline_5/Data_m_axi_gmem] [get_bd_addr_segs axi_bram_ctrl_0/S_AXI/Mem0]
assign_bd_address -offset 0x0000000040008000 -range 32K -target_address_space [get_bd_addr_spaces multicycle_pipeline_5/Data_m_axi_gmem] [get_bd_addr_segs axi_bram_ctrl_1/S_AXI/Mem0]
assign_bd_address -offset 0x0000000040010000 -range 32K -target_address_space [get_bd_addr_spaces multicycle_pipeline_5/Data_m_axi_gmem] [get_bd_addr_segs axi_bram_ctrl_2/S_AXI/Mem0]
assign_bd_address -offset 0x0000000040018000 -range 32K -target_address_space [get_bd_addr_spaces multicycle_pipeline_5/Data_m_axi_gmem] [get_bd_addr_segs axi_bram_ctrl_3/S_AXI/Mem0]
assign_bd_address -offset 0x0000000040020000 -range 32K -target_address_space [get_bd_addr_spaces multicycle_pipeline_5/Data_m_axi_gmem] [get_bd_addr_segs axi_bram_ctrl_4/S_AXI/Mem0]
assign_bd_address -offset 0x0000000040028000 -range 32K -target_address_space [get_bd_addr_spaces multicycle_pipeline_5/Data_m_axi_gmem] [get_bd_addr_segs axi_bram_ctrl_5/S_AXI/Mem0]
assign_bd_address -offset 0x0000000040030000 -range 32K -target_address_space [get_bd_addr_spaces multicycle_pipeline_5/Data_m_axi_gmem] [get_bd_addr_segs axi_bram_ctrl_6/S_AXI/Mem0]
assign_bd_address -offset 0x0000000040038000 -range 32K -target_address_space [get_bd_addr_spaces multicycle_pipeline_5/Data_m_axi_gmem] [get_bd_addr_segs axi_bram_ctrl_7/S_AXI/Mem0]
exclude_bd_addr_seg -offset 0x0000000040040000 -range 64K -target_address_space [get_bd_addr_spaces multicycle_pipeline_5/Data_m_axi_gmem] [get_bd_addr_segs multicycle_pipeline_0/s_axi_control/Reg]
exclude_bd_addr_seg -offset 0x0000000040050000 -range 64K -target_address_space [get_bd_addr_spaces multicycle_pipeline_5/Data_m_axi_gmem] [get_bd_addr_segs multicycle_pipeline_1/s_axi_control/Reg]
exclude_bd_addr_seg -offset 0x0000000040060000 -range 64K -target_address_space [get_bd_addr_spaces multicycle_pipeline_5/Data_m_axi_gmem] [get_bd_addr_segs multicycle_pipeline_2/s_axi_control/Reg]
exclude_bd_addr_seg -offset 0x0000000040070000 -range 64K -target_address_space [get_bd_addr_spaces multicycle_pipeline_5/Data_m_axi_gmem] [get_bd_addr_segs multicycle_pipeline_3/s_axi_control/Reg]
exclude_bd_addr_seg -offset 0x0000000040080000 -range 64K -target_address_space [get_bd_addr_spaces multicycle_pipeline_5/Data_m_axi_gmem] [get_bd_addr_segs multicycle_pipeline_4/s_axi_control/Reg]
exclude_bd_addr_seg -offset 0x0000000040090000 -range 64K -target_address_space [get_bd_addr_spaces multicycle_pipeline_5/Data_m_axi_gmem] [get_bd_addr_segs multicycle_pipeline_5/s_axi_control/Reg]
exclude_bd_addr_seg -offset 0x00000000400A0000 -range 64K -target_address_space [get_bd_addr_spaces multicycle_pipeline_5/Data_m_axi_gmem] [get_bd_addr_segs multicycle_pipeline_6/s_axi_control/Reg]
exclude_bd_addr_seg -offset 0x00000000400B0000 -range 64K -target_address_space [get_bd_addr_spaces multicycle_pipeline_5/Data_m_axi_gmem] [get_bd_addr_segs multicycle_pipeline_7/s_axi_control/Reg]
assign_bd_address -offset 0x0000000040000000 -range 32K -target_address_space [get_bd_addr_spaces multicycle_pipeline_6/Data_m_axi_gmem] [get_bd_addr_segs axi_bram_ctrl_0/S_AXI/Mem0]
assign_bd_address -offset 0x0000000040008000 -range 32K -target_address_space [get_bd_addr_spaces multicycle_pipeline_6/Data_m_axi_gmem] [get_bd_addr_segs axi_bram_ctrl_1/S_AXI/Mem0]
assign_bd_address -offset 0x0000000040010000 -range 32K -target_address_space [get_bd_addr_spaces multicycle_pipeline_6/Data_m_axi_gmem] [get_bd_addr_segs axi_bram_ctrl_2/S_AXI/Mem0]
assign_bd_address -offset 0x0000000040018000 -range 32K -target_address_space [get_bd_addr_spaces multicycle_pipeline_6/Data_m_axi_gmem] [get_bd_addr_segs axi_bram_ctrl_3/S_AXI/Mem0]
assign_bd_address -offset 0x0000000040020000 -range 32K -target_address_space [get_bd_addr_spaces multicycle_pipeline_6/Data_m_axi_gmem] [get_bd_addr_segs axi_bram_ctrl_4/S_AXI/Mem0]
assign_bd_address -offset 0x0000000040028000 -range 32K -target_address_space [get_bd_addr_spaces multicycle_pipeline_6/Data_m_axi_gmem] [get_bd_addr_segs axi_bram_ctrl_5/S_AXI/Mem0]
assign_bd_address -offset 0x0000000040030000 -range 32K -target_address_space [get_bd_addr_spaces multicycle_pipeline_6/Data_m_axi_gmem] [get_bd_addr_segs axi_bram_ctrl_6/S_AXI/Mem0]
assign_bd_address -offset 0x0000000040038000 -range 32K -target_address_space [get_bd_addr_spaces multicycle_pipeline_6/Data_m_axi_gmem] [get_bd_addr_segs axi_bram_ctrl_7/S_AXI/Mem0]
exclude_bd_addr_seg -offset 0x0000000040040000 -range 64K -target_address_space [get_bd_addr_spaces multicycle_pipeline_6/Data_m_axi_gmem] [get_bd_addr_segs multicycle_pipeline_0/s_axi_control/Reg]
exclude_bd_addr_seg -offset 0x0000000040050000 -range 64K -target_address_space [get_bd_addr_spaces multicycle_pipeline_6/Data_m_axi_gmem] [get_bd_addr_segs multicycle_pipeline_1/s_axi_control/Reg]
exclude_bd_addr_seg -offset 0x0000000040060000 -range 64K -target_address_space [get_bd_addr_spaces multicycle_pipeline_6/Data_m_axi_gmem] [get_bd_addr_segs multicycle_pipeline_2/s_axi_control/Reg]
exclude_bd_addr_seg -offset 0x0000000040070000 -range 64K -target_address_space [get_bd_addr_spaces multicycle_pipeline_6/Data_m_axi_gmem] [get_bd_addr_segs multicycle_pipeline_3/s_axi_control/Reg]
exclude_bd_addr_seg -offset 0x0000000040080000 -range 64K -target_address_space [get_bd_addr_spaces multicycle_pipeline_6/Data_m_axi_gmem] [get_bd_addr_segs multicycle_pipeline_4/s_axi_control/Reg]
exclude_bd_addr_seg -offset 0x0000000040090000 -range 64K -target_address_space [get_bd_addr_spaces multicycle_pipeline_6/Data_m_axi_gmem] [get_bd_addr_segs multicycle_pipeline_5/s_axi_control/Reg]
exclude_bd_addr_seg -offset 0x00000000400A0000 -range 64K -target_address_space [get_bd_addr_spaces multicycle_pipeline_6/Data_m_axi_gmem] [get_bd_addr_segs multicycle_pipeline_6/s_axi_control/Reg]
exclude_bd_addr_seg -offset 0x00000000400B0000 -range 64K -target_address_space [get_bd_addr_spaces multicycle_pipeline_6/Data_m_axi_gmem] [get_bd_addr_segs multicycle_pipeline_7/s_axi_control/Reg]
assign_bd_address -offset 0x0000000040000000 -range 32K -target_address_space [get_bd_addr_spaces multicycle_pipeline_7/Data_m_axi_gmem] [get_bd_addr_segs axi_bram_ctrl_0/S_AXI/Mem0]
assign_bd_address -offset 0x0000000040008000 -range 32K -target_address_space [get_bd_addr_spaces multicycle_pipeline_7/Data_m_axi_gmem] [get_bd_addr_segs axi_bram_ctrl_1/S_AXI/Mem0]
assign_bd_address -offset 0x0000000040010000 -range 32K -target_address_space [get_bd_addr_spaces multicycle_pipeline_7/Data_m_axi_gmem] [get_bd_addr_segs axi_bram_ctrl_2/S_AXI/Mem0]
assign_bd_address -offset 0x0000000040018000 -range 32K -target_address_space [get_bd_addr_spaces multicycle_pipeline_7/Data_m_axi_gmem] [get_bd_addr_segs axi_bram_ctrl_3/S_AXI/Mem0]
assign_bd_address -offset 0x0000000040020000 -range 32K -target_address_space [get_bd_addr_spaces multicycle_pipeline_7/Data_m_axi_gmem] [get_bd_addr_segs axi_bram_ctrl_4/S_AXI/Mem0]
assign_bd_address -offset 0x0000000040028000 -range 32K -target_address_space [get_bd_addr_spaces multicycle_pipeline_7/Data_m_axi_gmem] [get_bd_addr_segs axi_bram_ctrl_5/S_AXI/Mem0]
assign_bd_address -offset 0x0000000040030000 -range 32K -target_address_space [get_bd_addr_spaces multicycle_pipeline_7/Data_m_axi_gmem] [get_bd_addr_segs axi_bram_ctrl_6/S_AXI/Mem0]
assign_bd_address -offset 0x0000000040038000 -range 32K -target_address_space [get_bd_addr_spaces multicycle_pipeline_7/Data_m_axi_gmem] [get_bd_addr_segs axi_bram_ctrl_7/S_AXI/Mem0]
exclude_bd_addr_seg -offset 0x0000000040040000 -range 64K -target_address_space [get_bd_addr_spaces multicycle_pipeline_7/Data_m_axi_gmem] [get_bd_addr_segs multicycle_pipeline_0/s_axi_control/Reg]
exclude_bd_addr_seg -offset 0x0000000040050000 -range 64K -target_address_space [get_bd_addr_spaces multicycle_pipeline_7/Data_m_axi_gmem] [get_bd_addr_segs multicycle_pipeline_1/s_axi_control/Reg]
exclude_bd_addr_seg -offset 0x0000000040060000 -range 64K -target_address_space [get_bd_addr_spaces multicycle_pipeline_7/Data_m_axi_gmem] [get_bd_addr_segs multicycle_pipeline_2/s_axi_control/Reg]
exclude_bd_addr_seg -offset 0x0000000040070000 -range 64K -target_address_space [get_bd_addr_spaces multicycle_pipeline_7/Data_m_axi_gmem] [get_bd_addr_segs multicycle_pipeline_3/s_axi_control/Reg]
exclude_bd_addr_seg -offset 0x0000000040080000 -range 64K -target_address_space [get_bd_addr_spaces multicycle_pipeline_7/Data_m_axi_gmem] [get_bd_addr_segs multicycle_pipeline_4/s_axi_control/Reg]
exclude_bd_addr_seg -offset 0x0000000040090000 -range 64K -target_address_space [get_bd_addr_spaces multicycle_pipeline_7/Data_m_axi_gmem] [get_bd_addr_segs multicycle_pipeline_5/s_axi_control/Reg]
exclude_bd_addr_seg -offset 0x00000000400A0000 -range 64K -target_address_space [get_bd_addr_spaces multicycle_pipeline_7/Data_m_axi_gmem] [get_bd_addr_segs multicycle_pipeline_6/s_axi_control/Reg]
exclude_bd_addr_seg -offset 0x00000000400B0000 -range 64K -target_address_space [get_bd_addr_spaces multicycle_pipeline_7/Data_m_axi_gmem] [get_bd_addr_segs multicycle_pipeline_7/s_axi_control/Reg]
assign_bd_address -offset 0x40000000 -range 32K -target_address_space [get_bd_addr_spaces processing_system7_0/Data] [get_bd_addr_segs axi_bram_ctrl_0/S_AXI/Mem0]
assign_bd_address -offset 0x40008000 -range 32K -target_address_space [get_bd_addr_spaces processing_system7_0/Data] [get_bd_addr_segs axi_bram_ctrl_1/S_AXI/Mem0]
assign_bd_address -offset 0x40010000 -range 32K -target_address_space [get_bd_addr_spaces processing_system7_0/Data] [get_bd_addr_segs axi_bram_ctrl_2/S_AXI/Mem0]
assign_bd_address -offset 0x40018000 -range 32K -target_address_space [get_bd_addr_spaces processing_system7_0/Data] [get_bd_addr_segs axi_bram_ctrl_3/S_AXI/Mem0]
assign_bd_address -offset 0x40020000 -range 32K -target_address_space [get_bd_addr_spaces processing_system7_0/Data] [get_bd_addr_segs axi_bram_ctrl_4/S_AXI/Mem0]
assign_bd_address -offset 0x40028000 -range 32K -target_address_space [get_bd_addr_spaces processing_system7_0/Data] [get_bd_addr_segs axi_bram_ctrl_5/S_AXI/Mem0]
assign_bd_address -offset 0x40030000 -range 32K -target_address_space [get_bd_addr_spaces processing_system7_0/Data] [get_bd_addr_segs axi_bram_ctrl_6/S_AXI/Mem0]
assign_bd_address -offset 0x40038000 -range 32K -target_address_space [get_bd_addr_spaces processing_system7_0/Data] [get_bd_addr_segs axi_bram_ctrl_7/S_AXI/Mem0]
assign_bd_address -offset 0x40040000 -range 64K -target_address_space [get_bd_addr_spaces processing_system7_0/Data] [get_bd_addr_segs multicycle_pipeline_0/s_axi_control/Reg]
assign_bd_address -offset 0x40050000 -range 64K -target_address_space [get_bd_addr_spaces processing_system7_0/Data] [get_bd_addr_segs multicycle_pipeline_1/s_axi_control/Reg]
assign_bd_address -offset 0x40060000 -range 64K -target_address_space [get_bd_addr_spaces processing_system7_0/Data] [get_bd_addr_segs multicycle_pipeline_2/s_axi_control/Reg]
assign_bd_address -offset 0x40070000 -range 64K -target_address_space [get_bd_addr_spaces processing_system7_0/Data] [get_bd_addr_segs multicycle_pipeline_3/s_axi_control/Reg]
assign_bd_address -offset 0x40080000 -range 64K -target_address_space [get_bd_addr_spaces processing_system7_0/Data] [get_bd_addr_segs multicycle_pipeline_4/s_axi_control/Reg]
assign_bd_address -offset 0x40090000 -range 64K -target_address_space [get_bd_addr_spaces processing_system7_0/Data] [get_bd_addr_segs multicycle_pipeline_5/s_axi_control/Reg]
assign_bd_address -offset 0x400A0000 -range 64K -target_address_space [get_bd_addr_spaces processing_system7_0/Data] [get_bd_addr_segs multicycle_pipeline_6/s_axi_control/Reg]
assign_bd_address -offset 0x400B0000 -range 64K -target_address_space [get_bd_addr_spaces processing_system7_0/Data] [get_bd_addr_segs multicycle_pipeline_7/s_axi_control/Reg]

validate_bd_design
save_bd_design
